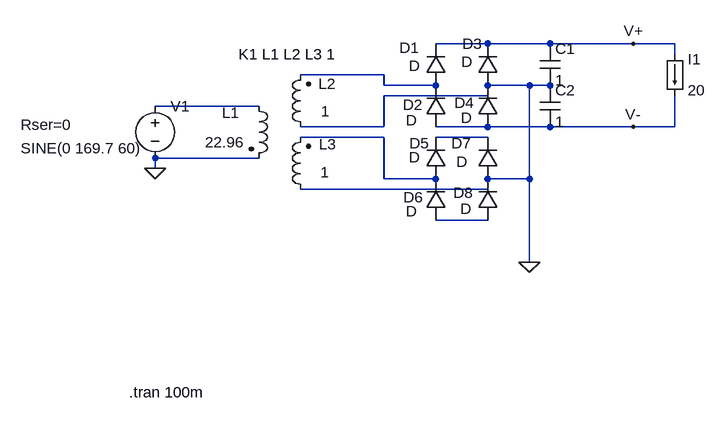
[diagram p0: schematic Transformer.asc]
Transformer.asc, the LTspice schematic file:
Version 4
SHEET 1 2164 680
WIRE 496 64 416 64
WIRE 592 64 496 64
WIRE 720 64 592 64
WIRE 784 64 720 64
WIRE 784 80 784 64
WIRE 336 112 208 112
WIRE 336 128 336 112
WIRE 416 128 336 128
WIRE 560 128 496 128
WIRE 592 128 560 128
WIRE 496 144 496 128
WIRE 496 144 336 144
WIRE 144 160 -16 160
WIRE 336 192 336 144
WIRE 336 192 208 192
WIRE 496 192 416 192
WIRE 592 192 496 192
WIRE 720 192 592 192
WIRE 784 192 784 144
WIRE 784 192 720 192
WIRE 336 208 208 208
WIRE 496 208 416 208
WIRE 144 240 -16 240
WIRE -16 256 -16 240
WIRE 336 272 336 208
WIRE 416 272 336 272
WIRE 560 272 560 128
WIRE 560 272 496 272
WIRE 496 288 496 272
WIRE 496 288 208 288
WIRE 496 336 416 336
WIRE 560 400 560 272
FLAG -16 256 0
FLAG 560 400 0
FLAG 720 64 V+
FLAG 720 192 V-
SYMBOL ind2 128 144 R0
WINDOW 0 -41 26 Left 2
WINDOW 3 -67 72 Left 2
SYMATTR InstName L1
SYMATTR Value 22.96
SYMATTR Type ind
SYMATTR SpiceLine Rser=1
SYMBOL ind2 224 208 R180
WINDOW 0 -38 82 Left 2
WINDOW 3 -29 40 Left 2
SYMATTR InstName L2
SYMATTR Value 1
SYMATTR Type ind
SYMATTR SpiceLine Rser=1
SYMBOL voltage -16 144 R0
WINDOW 3 -207 81 Left 2
WINDOW 123 24 180 Left 2
WINDOW 39 -207 45 Left 2
SYMATTR Value SINE(0 169.7 60)
SYMATTR SpiceLine Rser=0
SYMATTR InstName V1
SYMBOL ind2 224 304 R180
WINDOW 0 -39 85 Left 2
WINDOW 3 -28 42 Left 2
SYMATTR InstName L3
SYMATTR Value 1
SYMATTR Type ind
SYMBOL diode 432 128 R180
WINDOW 0 41 58 Left 2
WINDOW 3 40 30 Left 2
SYMATTR InstName D1
SYMBOL diode 432 192 R180
WINDOW 0 36 34 Left 2
WINDOW 3 45 10 Left 2
SYMATTR InstName D2
SYMBOL diode 512 128 R180
WINDOW 0 24 64 Left 2
WINDOW 3 39 36 Left 2
SYMATTR InstName D3
SYMBOL diode 512 192 R180
WINDOW 0 37 37 Left 2
WINDOW 3 40 14 Left 2
SYMATTR InstName D4
SYMBOL diode 432 272 R180
WINDOW 0 26 55 Left 2
WINDOW 3 40 33 Left 2
SYMATTR InstName D5
SYMBOL diode 432 336 R180
WINDOW 0 35 36 Left 2
WINDOW 3 45 14 Left 2
SYMATTR InstName D6
SYMBOL diode 512 272 R180
WINDOW 0 41 55 Left 2
WINDOW 3 47 26 Left 2
SYMATTR InstName D7
SYMBOL diode 512 336 R180
WINDOW 0 38 43 Left 2
WINDOW 3 41 18 Left 2
SYMATTR InstName D8
SYMBOL cap 576 64 R0
SYMATTR InstName C1
SYMATTR Value 1
SYMBOL cap 576 128 R0
SYMATTR InstName C2
SYMATTR Value 1
SYMBOL load 768 80 R0
WINDOW 123 0 0 Left 2
WINDOW 39 0 0 Left 2
SYMATTR InstName I1
SYMATTR Value 20
TEXT 112 80 Left 2 !K1 L1 L2 L3 1
TEXT -56 600 Left 2 !.tran 100m

The netlist it stands for:
* Transformer.asc
L1 N002 0 22.96 Rser=1
L2 0 N001 1 Rser=1
V1 N002 0 SINE(0 169.7 60) Rser=0
L3 0 N003 1
D1 N001 V+ D
D2 V- N001 D
D3 0 V+ D
D4 V- 0 D
D5 N003 N004 D
D6 N005 N003 D
D7 0 N004 D
D8 N005 0 D
C1 V+ 0 1
C2 0 V- 1
I1 V+ V- 20
.model D D
.lib standard.dio
K1 L1 L2 L3 1
.tran 100m
.backanno
.end